# Altium project Tetris.PrjPCB
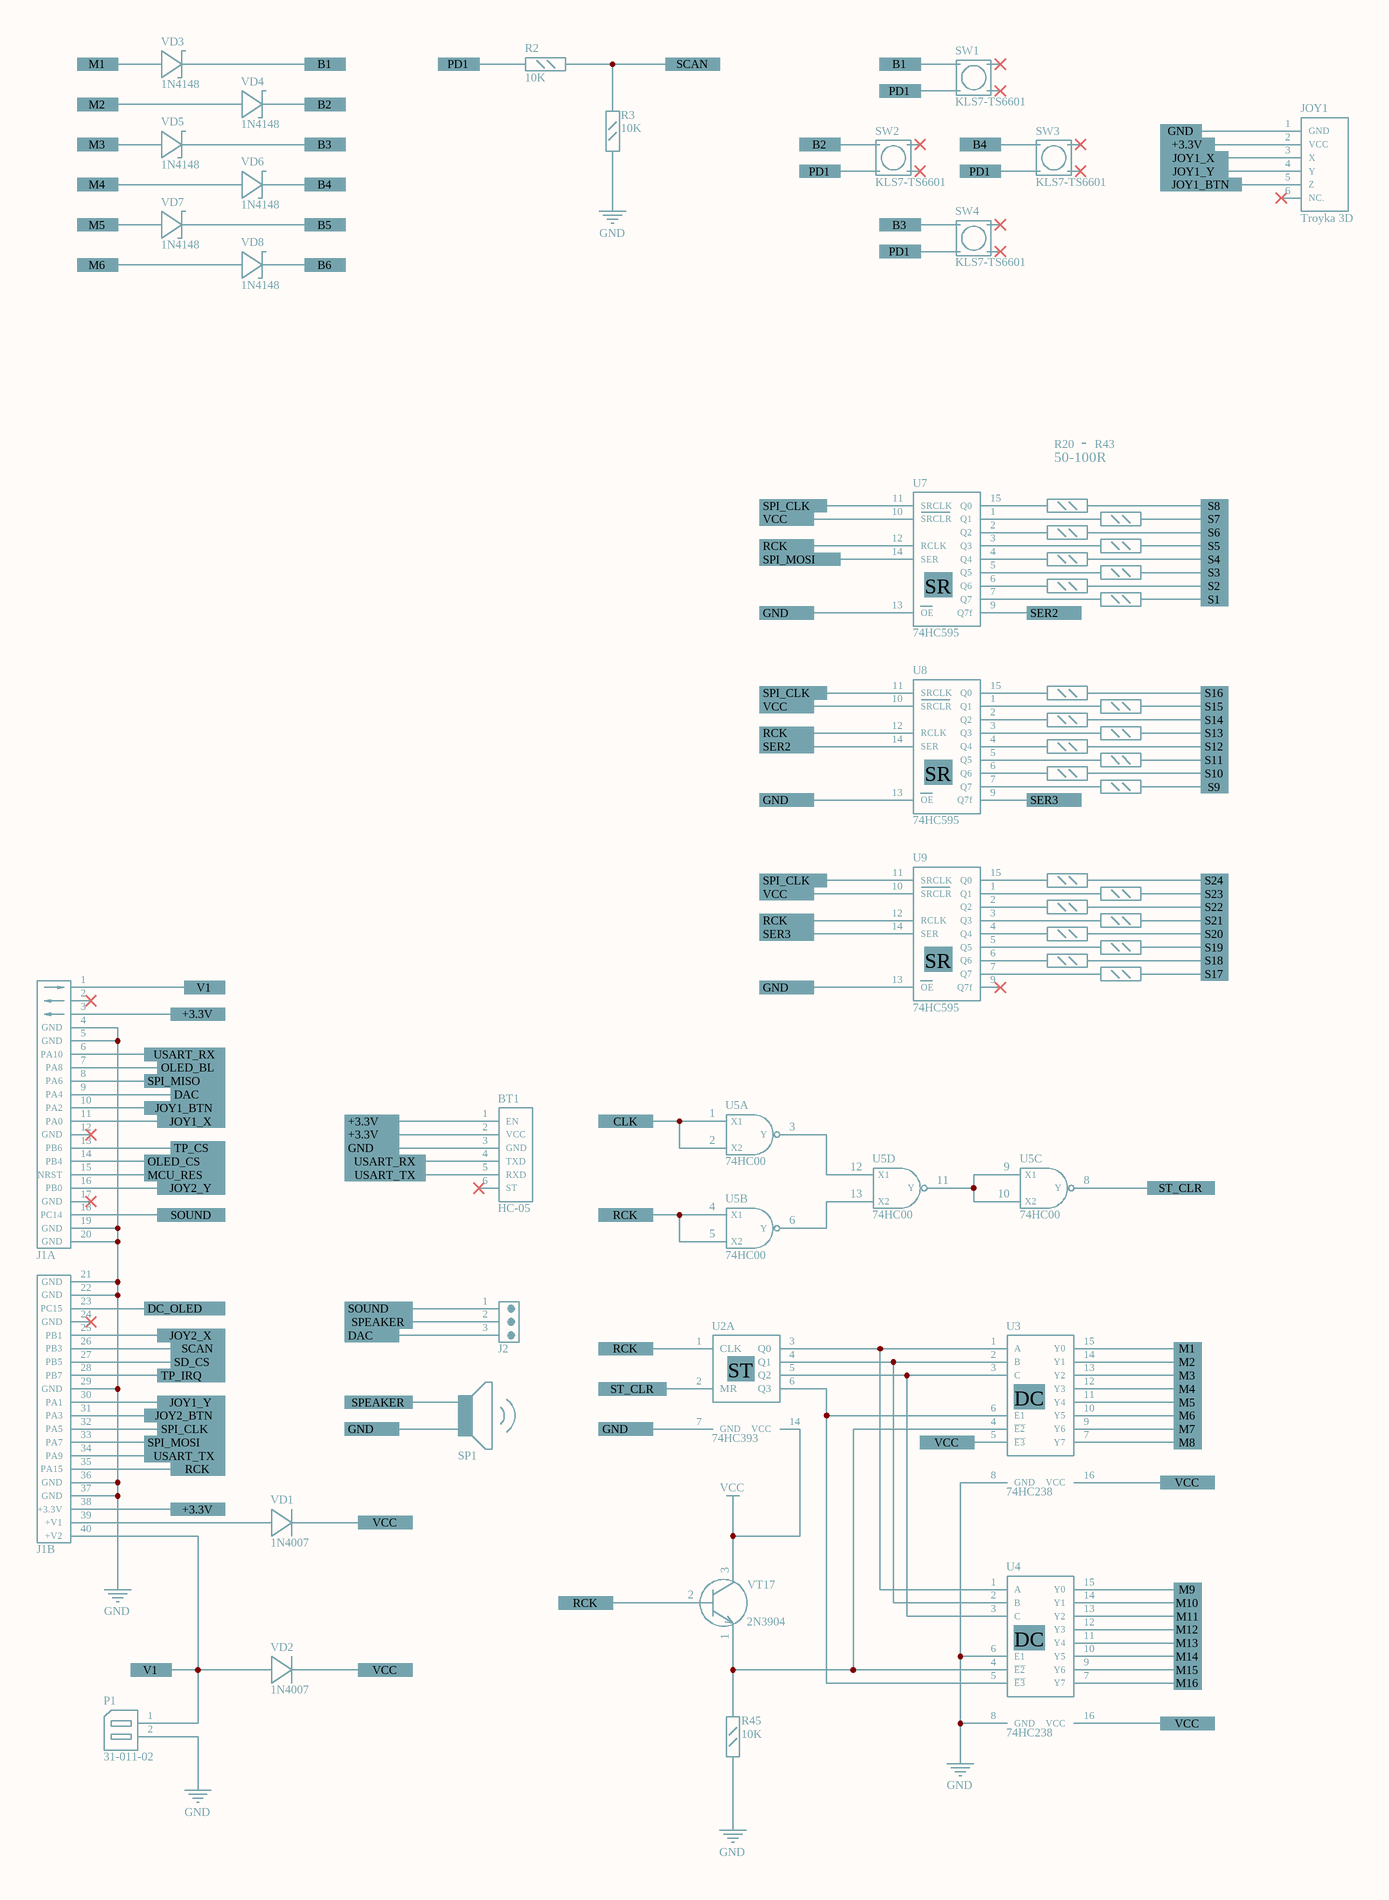
[diagram p0: Tetris.SchDoc, left]
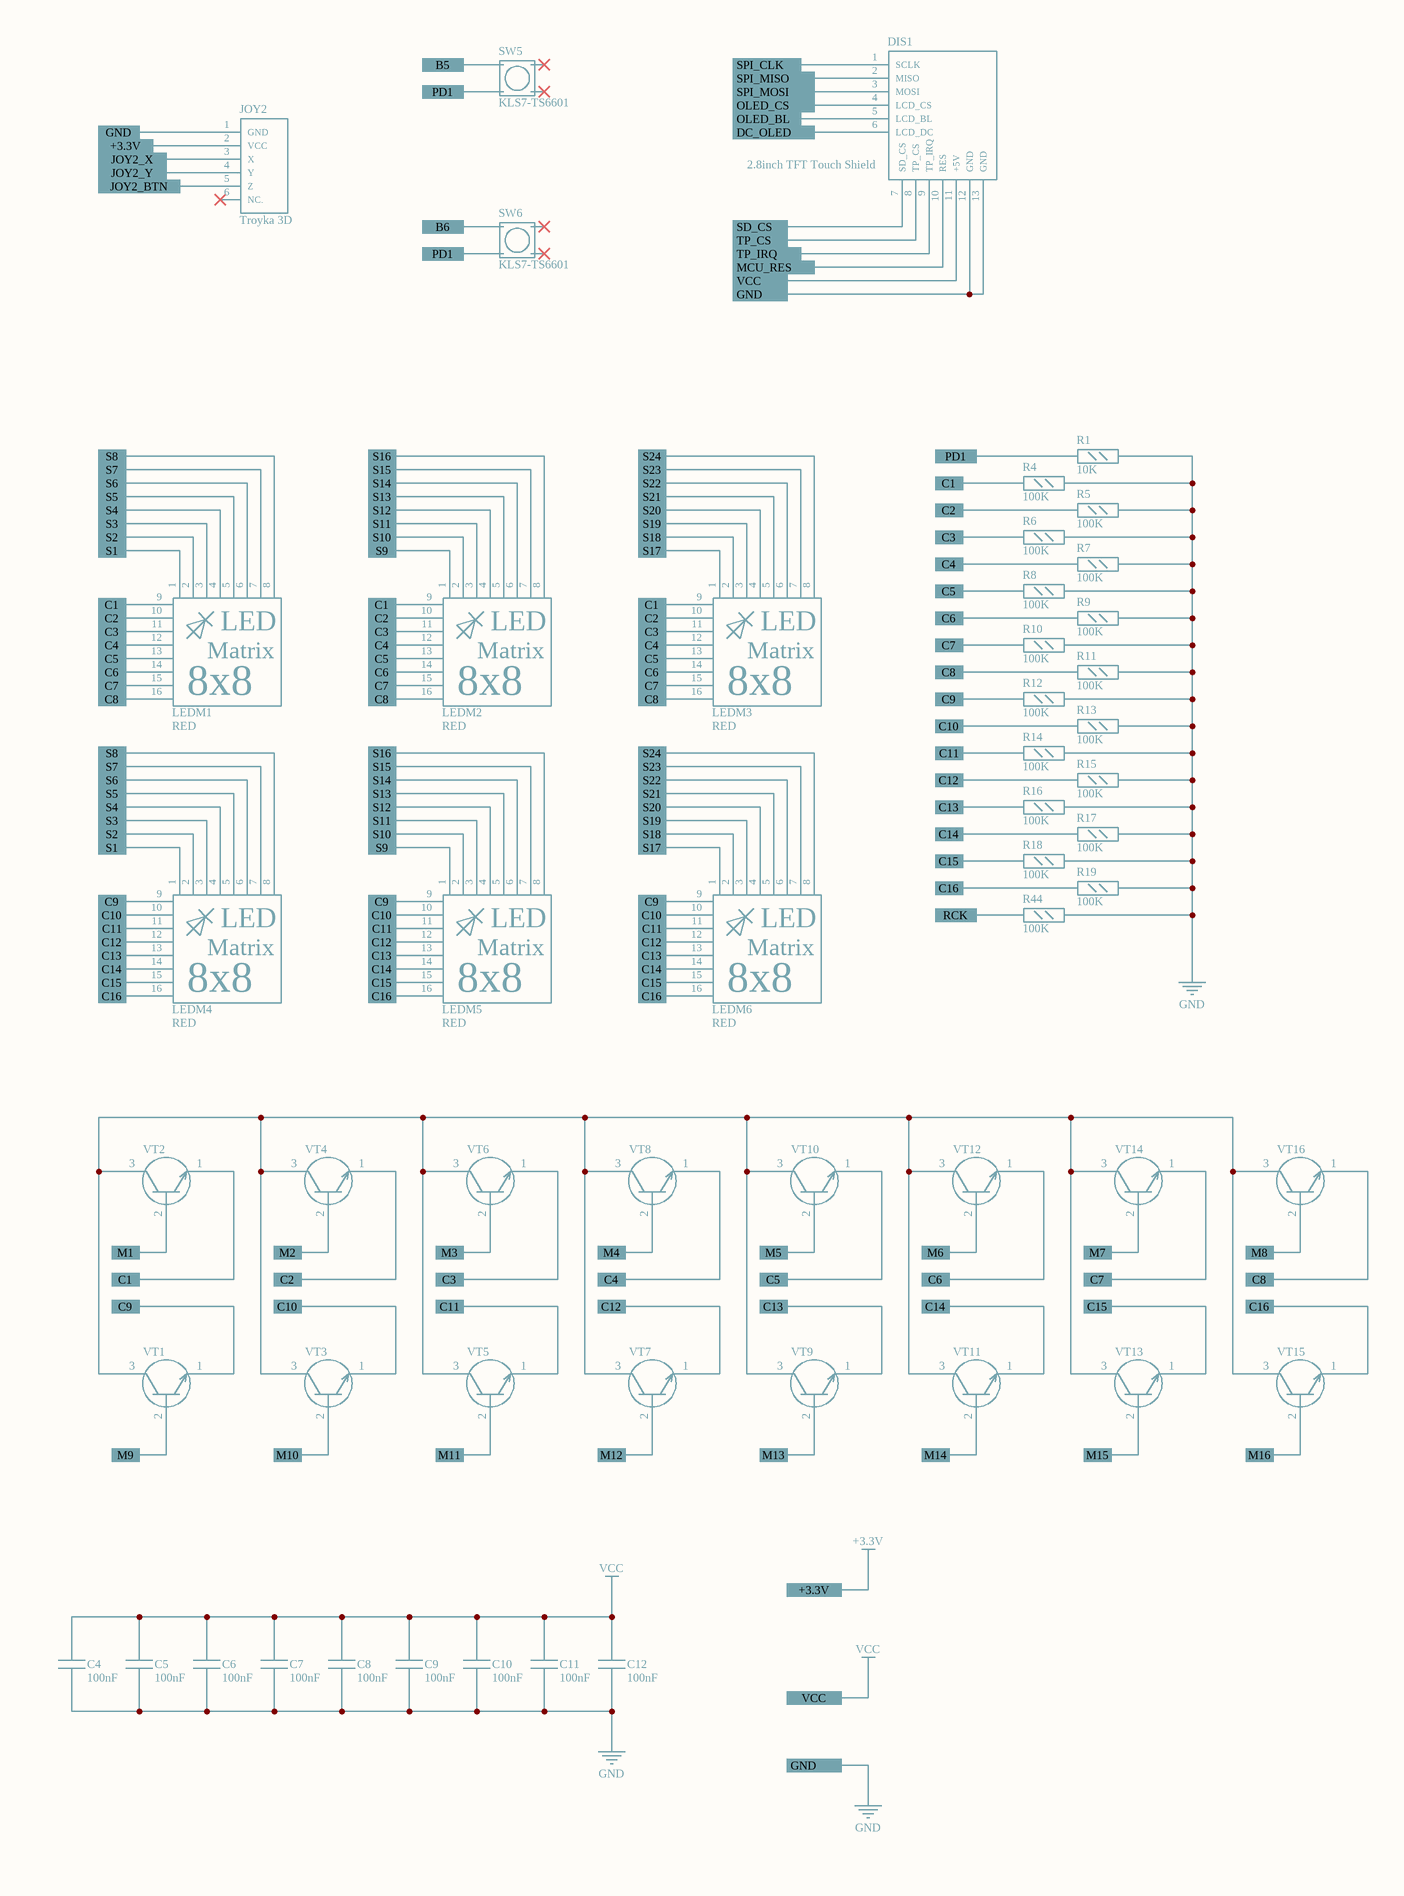
[diagram p1: Tetris.SchDoc, right]
1 sheet, 106 parts. Net scope: flat (ports and power ports of the same name join across sheets).
Board file: Tetris.PcbDoc

## Sheet Tetris.SchDoc
size A2

### Parts
BT1  HC-05  [6X1M-D]
C4  100nF  [C0805]
C5  100nF  [C0805]
C6  100nF  [C0805]
C7  100nF  [C0805]
C8  100nF  [C0805]
C9  100nF  [C0805]
C10  100nF  [C0805]
C11  100nF  [C0805]
C12  100nF  [C0805]
DIS1  2.8inch TFT Touch Shield
J1  PLD-40D  [20X2F-D]  (value not drawn)  (parts A,B of 2)
J2  PLS_3  [3X1F]  (value not drawn)
JOY1  Troyka 3D  [JOY3X2]
JOY2  Troyka 3D  [JOY3X2]
LEDM1  RED  [MATRIX8X8]
LEDM2  RED  [MATRIX8X8]
LEDM3  RED  [MATRIX8X8]
LEDM4  RED  [MATRIX8X8]
LEDM5  RED  [MATRIX8X8]
LEDM6  RED  [MATRIX8X8]
P1  31-011-02  [H2-5.08]
R1  10K  [R0805]
R2  10K  [R0805]
R3  10K  [R0805]
R4  100K  [R0805]
R5  100K  [R0805]
R6  100K  [R0805]
R7  100K  [R0805]
R8  100K  [R0805]
R9  100K  [R0805]
R10  100K  [R0805]
R11  100K  [R0805]
R12  100K  [R0805]
R13  100K  [R0805]
R14  100K  [R0805]
R15  100K  [R0805]
R16  100K  [R0805]
R17  100K  [R0805]
R18  100K  [R0805]
R19  100K  [R0805]
R20  56  [R0805]  (value not drawn)
R21  56  [R0805]  (value not drawn)
R22  56  [R0805]  (value not drawn)
R23  56  [R0805]  (value not drawn)
R24  56  [R0805]  (value not drawn)
R25  56  [R0805]  (value not drawn)
R26  56  [R0805]  (value not drawn)
R27  56  [R0805]  (value not drawn)
R28  56  [R0805]  (value not drawn)
R29  56  [R0805]  (value not drawn)
R30  56  [R0805]  (value not drawn)
R31  56  [R0805]  (value not drawn)
R32  56  [R0805]  (value not drawn)
R33  56  [R0805]  (value not drawn)
R34  56  [R0805]  (value not drawn)
R35  56  [R0805]  (value not drawn)
R36  56  [R0805]  (value not drawn)
R37  56  [R0805]  (value not drawn)
R38  56  [R0805]  (value not drawn)
R39  56  [R0805]  (value not drawn)
R40  56  [R0805]  (value not drawn)
R41  56  [R0805]  (value not drawn)
R42  56  [R0805]  (value not drawn)
R43  56  [R0805]  (value not drawn)
R44  100K  [R0805]
R45  10K  [R0805]
SP1  40KS08P  [SPEAKER-5.08]  (value not drawn)
SW1  KLS7-TS6601  [BUT6.5x4.5]
SW2  KLS7-TS6601  [BUT6.5x4.5]
SW3  KLS7-TS6601  [BUT6.5x4.5]
SW4  KLS7-TS6601  [BUT6.5x4.5]
SW5  KLS7-TS6601  [BUT6.5x4.5]
SW6  KLS7-TS6601  [BUT6.5x4.5]
U2  74HC393  [DIP14]  (part A of 2)
U3  74HC238
U4  74HC238
U5  74HC00  [SOIC14]  (parts A,B,C,D of 4)
U7  74HC595  [SOIC16]
U8  74HC595  [SOIC16]
U9  74HC595  [SOIC16]
VD1  1N4007  [AXIAL10D-BL]
VD2  1N4007  [AXIAL10D-BL]
VD3  1N4148  [AXIAL10D-BL]
VD4  1N4148  [AXIAL10D-BL]
VD5  1N4148  [AXIAL10D-BL]
VD6  1N4148  [AXIAL10D-BL]
VD7  1N4148  [AXIAL10D-BL]
VD8  1N4148  [AXIAL10D-BL]
VT1  2N3904  [TO-92L]  (value not drawn)
VT2  2N3904  [TO-92L]  (value not drawn)
VT3  2N3904  [TO-92L]  (value not drawn)
VT4  2N3904  [TO-92L]  (value not drawn)
VT5  2N3904  [TO-92L]  (value not drawn)
VT6  2N3904  [TO-92L]  (value not drawn)
VT7  2N3904  [TO-92L]  (value not drawn)
VT8  2N3904  [TO-92L]  (value not drawn)
VT9  2N3904  [TO-92L]  (value not drawn)
VT10  2N3904  [TO-92L]  (value not drawn)
VT11  2N3904  [TO-92L]  (value not drawn)
VT12  2N3904  [TO-92L]  (value not drawn)
VT13  2N3904  [TO-92L]  (value not drawn)
VT14  2N3904  [TO-92L]  (value not drawn)
VT15  2N3904  [TO-92L]  (value not drawn)
VT16  2N3904  [TO-92L]  (value not drawn)
VT17  2N3904  [TO-92L]

### Ports
+3.3V, B1, B2, B3, B4, B5, B6, CLK, DAC, DC_OLED, GND, JOY1_BTN, JOY1_X, JOY1_Y, JOY2_BTN, JOY2_X, JOY2_Y, M1, M2, M3, M4, M5, M6, M7, M8, M9, M10, M11, M12, M13, M14, M15, M16, MCU_RES, OLED_BL, OLED_CS, PD1, RCK, S1, S2, S3, S4, S5, S6, S7, S8, S9, S10, S11, S12, S13, S14, S15, S16, S17, S18, S19, S20, S21, S22, S23, S24, SCAN, SD_CS, SER2, SER3, SOUND, SPEAKER, SPI_CLK, SPI_MISO, SPI_MOSI, ST_CLR, TP_CS, TP_IRQ, USART_RX, USART_TX, V1, VCC, С1, С2, С3, С4, С5, С6, С7, С8, С9, С10, С11, С12, С13, С14, С15, С16

### Nets
+3.3V: BT1.1(EN) BT1.2(VCC) J1.3 J1.38(+3.3V) JOY1.2(VCC) JOY2.2(VCC) ; port +3.3V
GND: BT1.3(GND) C4.1 C5.1 C6.1 C7.1 C8.1 C9.1 C10.1 C11.1 C12.1 DIS1.12(GND) DIS1.13(GND) J1.4(GND) J1.5(GND) J1.19(GND) J1.20(GND) J1.21(GND) J1.22(GND) J1.29(GND) J1.36(GND) J1.37(GND) JOY1.1(GND) JOY2.1(GND) P1.2 R1.2 R3.1 R4.2 R5.2 R6.2 R7.2 R8.2 R9.2 R10.2 R11.2 R12.2 R13.2 R14.2 R15.2 R16.2 R17.2 R18.2 R19.2 R44.2 R45.1 SP1.2 U2.7(GND) U3.8(GND) U4.6(E1) U4.8(GND) U5.7(GND) U7.8(GND) U7.13(OE) U8.8(GND) U8.13(OE) U9.8(GND) U9.13(OE) ; port GND
VCC: C4.2 C5.2 C6.2 C7.2 C8.2 C9.2 C10.2 C11.2 C12.2 DIS1.11(+5V) U2.14(VCC) U3.5(~{E3}) U3.16(VCC) U4.16(VCC) U5.14(VCC) U7.10(SRCLR) U7.16(VCC) U8.10(SRCLR) U8.16(VCC) U9.10(SRCLR) U9.16(VCC) VD1.2 VD2.2 VT17.3 ; port VCC
NetBT1_4: BT1.4(TXD) J1.6(PA10) ; port USART_RX
NetBT1_5: BT1.5(RXD) J1.34(PA9) ; port USART_TX
NetDIS1_1: DIS1.1(SCLK) J1.32(PA5) U7.11(SRCLK) U8.11(SRCLK) U9.11(SRCLK) ; port SPI_CLK
NetDIS1_2: DIS1.2(MISO) J1.8(PA6) ; port SPI_MISO
NetDIS1_3: DIS1.3(MOSI) J1.33(PA7) U7.14(SER) ; port SPI_MOSI
NetDIS1_4: DIS1.4(LCD_CS) J1.14(PB4) ; port OLED_CS
NetDIS1_5: DIS1.5(LCD_BL) J1.7(PA8) ; port OLED_BL
NetDIS1_6: DIS1.6(LCD_DC) J1.23(PC15) ; port DC_OLED
NetDIS1_7: DIS1.7(SD_CS) J1.27(PB5) ; port SD_CS
NetDIS1_8: DIS1.8(TP_CS) J1.13(PB6) ; port TP_CS
NetDIS1_9: DIS1.9(TP_IRQ) J1.28(PB7) ; port TP_IRQ
NetDIS1_10: DIS1.10(RES) J1.15(NRST) ; port MCU_RES
NetJ1_1: J1.1 J1.40(+V2) P1.1 VD2.1 ; port V1
NetJ1_9: J1.9(PA4) J2.3 ; port DAC
NetJ1_10: J1.10(PA2) JOY1.5(Z) ; port JOY1_BTN
NetJ1_11: J1.11(PA0) JOY1.3(X) ; port JOY1_X
NetJ1_16: J1.16(PB0) JOY2.4(Y) ; port JOY2_Y
NetJ1_18: J1.18(PC14) J2.1 ; port SOUND
NetJ1_25: J1.25(PB1) JOY2.3(X) ; port JOY2_X
NetJ1_26: J1.26(PB3) R2.2 R3.2 ; port SCAN
NetJ1_30: J1.30(PA1) JOY1.4(Y) ; port JOY1_Y
NetJ1_31: J1.31(PA3) JOY2.5(Z) ; port JOY2_BTN
NetJ1_35: J1.35(PA15) R44.1 U2.1(CLK) U5.4(X1) U5.5(X2) U7.12(RCLK) U8.12(RCLK) U9.12(RCLK) VT17.2 ; port RCK
NetJ1_39: J1.39(+V1) VD1.1
NetJ2_2: J2.2 SP1.1 ; port SPEAKER
NetLEDM1_1: LEDM1.1 LEDM4.1 R41.2 ; port S1
NetLEDM1_2: LEDM1.2 LEDM4.2 R38.2 ; port S2
NetLEDM1_3: LEDM1.3 LEDM4.3 R35.2 ; port S3
NetLEDM1_4: LEDM1.4 LEDM4.4 R32.2 ; port S4
NetLEDM1_5: LEDM1.5 LEDM4.5 R29.2 ; port S5
NetLEDM1_6: LEDM1.6 LEDM4.6 R26.2 ; port S6
NetLEDM1_7: LEDM1.7 LEDM4.7 R23.2 ; port S7
NetLEDM1_8: LEDM1.8 LEDM4.8 R20.2 ; port S8
NetLEDM1_9: LEDM1.9 LEDM2.9 LEDM3.9 R4.1 VT2.1 ; port С1
NetLEDM1_10: LEDM1.10 LEDM2.10 LEDM3.10 R5.1 VT4.1 ; port С2
NetLEDM1_11: LEDM1.11 LEDM2.11 LEDM3.11 R6.1 VT6.1 ; port С3
NetLEDM1_12: LEDM1.12 LEDM2.12 LEDM3.12 R7.1 VT8.1 ; port С4
NetLEDM1_13: LEDM1.13 LEDM2.13 LEDM3.13 R8.1 VT10.1 ; port С5
NetLEDM1_14: LEDM1.14 LEDM2.14 LEDM3.14 R9.1 VT12.1 ; port С6
NetLEDM1_15: LEDM1.15 LEDM2.15 LEDM3.15 R10.1 VT14.1 ; port С7
NetLEDM1_16: LEDM1.16 LEDM2.16 LEDM3.16 R11.1 VT16.1 ; port С8
NetLEDM2_1: LEDM2.1 LEDM5.1 R42.2 ; port S9
NetLEDM2_2: LEDM2.2 LEDM5.2 R39.2 ; port S10
NetLEDM2_3: LEDM2.3 LEDM5.3 R36.2 ; port S11
NetLEDM2_4: LEDM2.4 LEDM5.4 R33.2 ; port S12
NetLEDM2_5: LEDM2.5 LEDM5.5 R30.2 ; port S13
NetLEDM2_6: LEDM2.6 LEDM5.6 R27.2 ; port S14
NetLEDM2_7: LEDM2.7 LEDM5.7 R24.2 ; port S15
NetLEDM2_8: LEDM2.8 LEDM5.8 R21.2 ; port S16
NetLEDM3_1: LEDM3.1 LEDM6.1 R43.2 ; port S17
NetLEDM3_2: LEDM3.2 LEDM6.2 R40.2 ; port S18
NetLEDM3_3: LEDM3.3 LEDM6.3 R37.2 ; port S19
NetLEDM3_4: LEDM3.4 LEDM6.4 R34.2 ; port S20
NetLEDM3_5: LEDM3.5 LEDM6.5 R31.2 ; port S21
NetLEDM3_6: LEDM3.6 LEDM6.6 R28.2 ; port S22
NetLEDM3_7: LEDM3.7 LEDM6.7 R25.2 ; port S23
NetLEDM3_8: LEDM3.8 LEDM6.8 R22.2 ; port S24
NetLEDM4_9: LEDM4.9 LEDM5.9 LEDM6.9 R12.1 VT1.1 ; port С9
NetLEDM4_10: LEDM4.10 LEDM5.10 LEDM6.10 R13.1 VT3.1 ; port С10
NetLEDM4_11: LEDM4.11 LEDM5.11 LEDM6.11 R14.1 VT5.1 ; port С11
NetLEDM4_12: LEDM4.12 LEDM5.12 LEDM6.12 R15.1 VT7.1 ; port С12
NetLEDM4_13: LEDM4.13 LEDM5.13 LEDM6.13 R16.1 VT9.1 ; port С13
NetLEDM4_14: LEDM4.14 LEDM5.14 LEDM6.14 R17.1 VT11.1 ; port С14
NetLEDM4_15: LEDM4.15 LEDM5.15 LEDM6.15 R18.1 VT13.1 ; port С15
NetLEDM4_16: LEDM4.16 LEDM5.16 LEDM6.16 R19.1 VT15.1 ; port С16
NetR1_1: R1.1 R2.1 SW1.2 SW2.2 SW3.2 SW4.2 SW5.2 SW6.2 ; port PD1
NetR20_1: R20.1 U7.15(Q0)
NetR21_1: R21.1 U8.15(Q0)
NetR22_1: R22.1 U9.15(Q0)
NetR23_1: R23.1 U7.1(Q1)
NetR24_1: R24.1 U8.1(Q1)
NetR25_1: R25.1 U9.1(Q1)
NetR26_1: R26.1 U7.2(Q2)
NetR27_1: R27.1 U8.2(Q2)
NetR28_1: R28.1 U9.2(Q2)
NetR29_1: R29.1 U7.3(Q3)
NetR30_1: R30.1 U8.3(Q3)
NetR31_1: R31.1 U9.3(Q3)
NetR32_1: R32.1 U7.4(Q4)
NetR33_1: R33.1 U8.4(Q4)
NetR34_1: R34.1 U9.4(Q4)
NetR35_1: R35.1 U7.5(Q5)
NetR36_1: R36.1 U8.5(Q5)
NetR37_1: R37.1 U9.5(Q5)
NetR38_1: R38.1 U7.6(Q6)
NetR39_1: R39.1 U8.6(Q6)
NetR40_1: R40.1 U9.6(Q6)
NetR41_1: R41.1 U7.7(Q7)
NetR42_1: R42.1 U8.7(Q7)
NetR43_1: R43.1 U9.7(Q7)
NetR45_2: R45.2 U3.4(~{E2}) U4.4(~{E2}) VT17.1
NetSW1_1: SW1.1 VD3.2 ; port B1
NetSW2_1: SW2.1 VD4.2 ; port B2
NetSW3_1: SW3.1 VD6.2 ; port B4
NetSW4_1: SW4.1 VD5.2 ; port B3
NetSW5_1: SW5.1 VD7.2 ; port B5
NetSW6_1: SW6.1 VD8.2 ; port B6
NetU2_2: U2.2(MR) U5.8(Y) ; port ST_CLR
NetU2_3: U2.3(Q0) U3.1(A) U4.1(A)
NetU2_4: U2.4(Q1) U3.2(B) U4.2(B)
NetU2_5: U2.5(Q2) U3.3(C) U4.3(C)
NetU2_6: U2.6(Q3) U3.6(E1) U4.5(~{E3})
NetU3_7: U3.7(Y7) VT16.2 ; port M8
NetU3_9: U3.9(Y6) VT14.2 ; port M7
NetU3_10: U3.10(Y5) VD8.1 VT12.2 ; port M6
NetU3_11: U3.11(Y4) VD7.1 VT10.2 ; port M5
NetU3_12: U3.12(Y3) VD6.1 VT8.2 ; port M4
NetU3_13: U3.13(Y2) VD5.1 VT6.2 ; port M3
NetU3_14: U3.14(Y1) VD4.1 VT4.2 ; port M2
NetU3_15: U3.15(Y0) VD3.1 VT2.2 ; port M1
NetU4_7: U4.7(Y7) VT15.2 ; port M16
NetU4_9: U4.9(Y6) VT13.2 ; port M15
NetU4_10: U4.10(Y5) VT11.2 ; port M14
NetU4_11: U4.11(Y4) VT9.2 ; port M13
NetU4_12: U4.12(Y3) VT7.2 ; port M12
NetU4_13: U4.13(Y2) VT5.2 ; port M11
NetU4_14: U4.14(Y1) VT3.2 ; port M10
NetU4_15: U4.15(Y0) VT1.2 ; port M9
NetU5_1: U5.1(X1) U5.2(X2) ; port CLK
NetU5_3: U5.3(Y) U5.12(X1)
NetU5_6: U5.6(Y) U5.13(X2)
NetU5_9: U5.9(X1) U5.10(X2) U5.11(Y)
NetU7_9: U7.9(Q7f) U8.14(SER) ; port SER2
NetU8_9: U8.9(Q7f) U9.14(SER) ; port SER3
NetVT1_3: VT1.3 VT2.3 VT3.3 VT4.3 VT5.3 VT6.3 VT7.3 VT8.3 VT9.3 VT10.3 VT11.3 VT12.3 VT13.3 VT14.3 VT15.3 VT16.3

Not connected (* = marked no-connect by the designer): BT1 6(ST)*; J1 2* 12(GND)* 17(GND)* 24(GND)*; JOY1 6(NC.)*; JOY2 6(NC.)*; SW1 3* 4*; SW2 3* 4*; SW3 3* 4*; SW4 3* 4*; SW5 3* 4*; SW6 3* 4*; U9 9(Q7f)*

### Notes on the sheet
- 50-100R
- -
- (in symbol 74HC238 (DC)) DC
- (in symbol 74HC393 (ST), part A) ST
- (in symbol 74HC595 (REG)) SR
- (in symbol LED_Matrix) LED; Matrix; 8x8

### Library data of the parts
BT1 = Bluetooth HC-05: Name: HC-05
C4-C12 = Cap: Value: 100nF
DIS1 = 2.8inch TFT Touch Shield: Manufacturer: WaveShare; Name: 2.8inch TFT Touch Shield
JOY1 JOY2 = Joystick: Name: Troyka 3D
LEDM1-LEDM6 = LED_Matrix: Name: RED
P1 = CHOP2: Name: 31-011-02
R1-R43 R45 = Res
  R1-R3 R45: Value: 10K
  R4-R19: Value: 100K
  R20-R43: Value: 56
R44 = Res: Value: 10K
SP1 = Speaker: Name: 40KS08P
SW1-SW6 = Button_2: Name: KLS7-TS6601
U2 = 74HC393 (ST): Name: 74HC393
U3 U4 = 74HC238 (DC): Name: 74HC238
U5 = 74HC00 (NAND): Name: 74HC00
U7-U9 = 74HC595 (REG): Name: 74HC595
VD1 VD2 = Diode: Name: 1N4007
VD3-VD8 = Schottky: Name: 1N4148
VT1-VT17 = NPN_EBC: Name: 2N3904